# Altium schematic sheet AltiumFirst_STM32.SchDoc
size A4; SheetNumber: 1; SheetTotal: 1
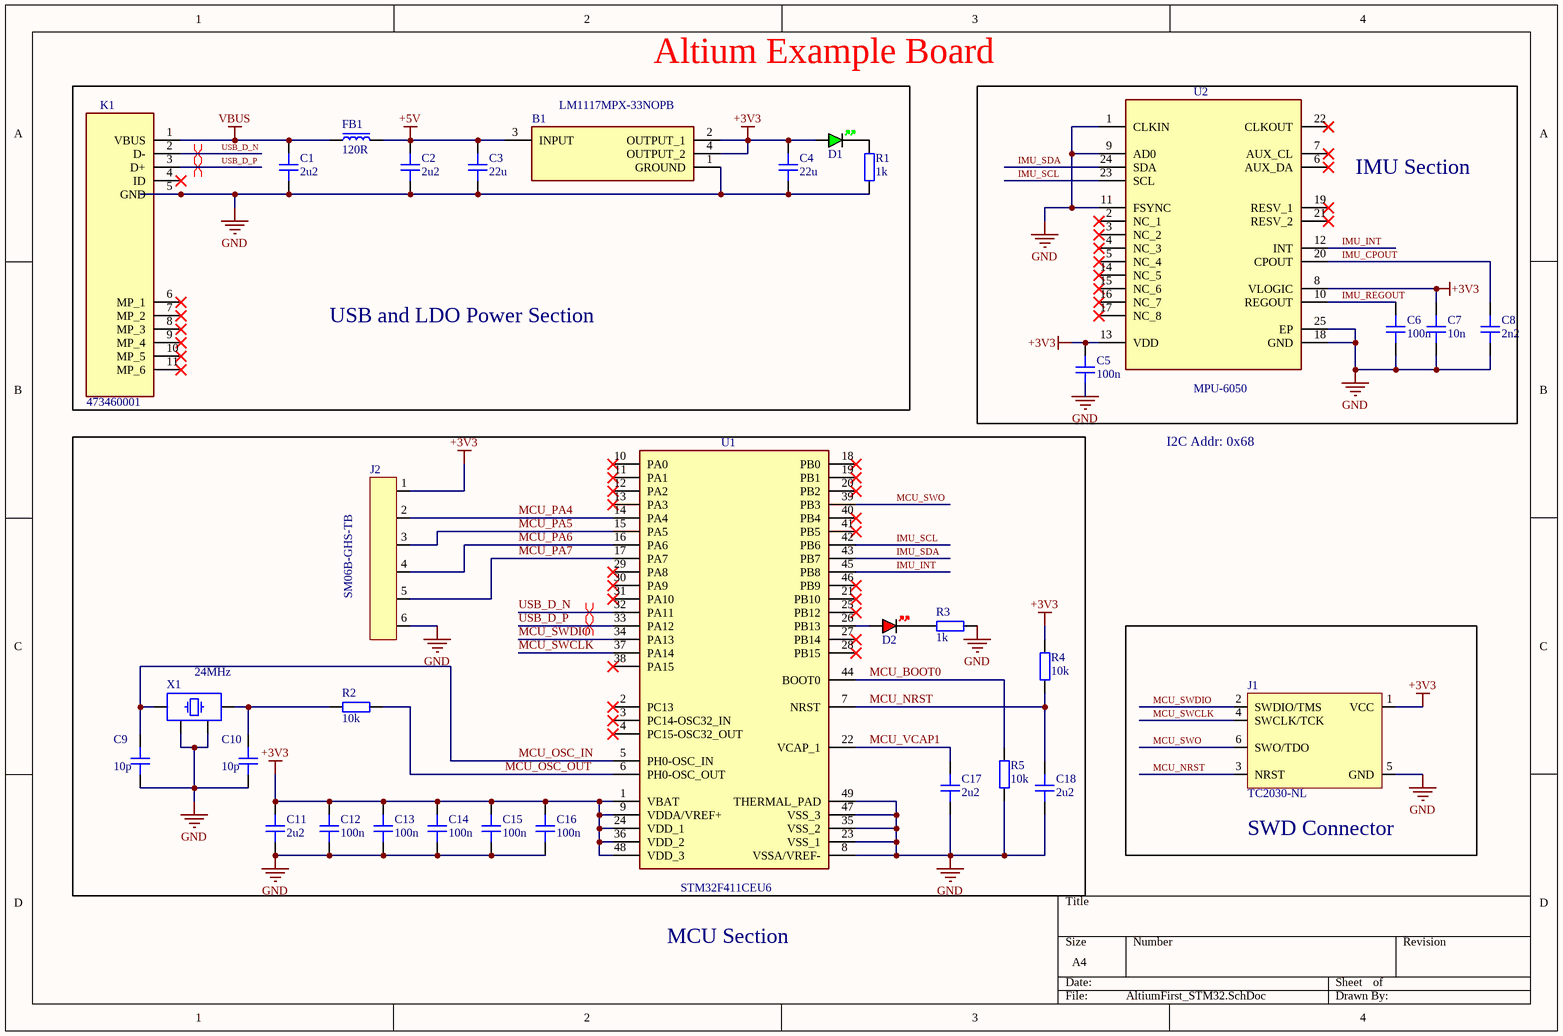
[diagram p0: AltiumFirst_STM32.SchDoc]

## Parts
B1  LM1117MPX-33NOPB  [SOT230P700X180-4N]
C1  2u2  [CAP_0603]
C2  2u2  [CAP_0603]
C3  22u  [CAP_0603]
C4  22u  [CAP_0603]
C5  100n  [CAP_0603]
C6  100n  [CAP_0603]
C7  10n  [CAP_0603]
C8  2n2  [CAP_0603]
C9  10p  [CAP_0603]
C10  10p  [CAP_0603]
C11  2u2  [CAP_0603]
C12  100n  [CAP_0603]
C13  100n  [CAP_0603]
C14  100n  [CAP_0603]
C15  100n  [CAP_0603]
C16  100n  [CAP_0603]
C17  2u2  [CAP_0603]
C18  2u2  [CAP_0603]
D1  GREEN  [LED_0603_GREEN]  (value not drawn)
D2  RED  [LED_0603_RED]  (value not drawn)
FB1  120R  [FB_0603]
J1  TC2030-NL  [TC2030-NL-FP]  (no BOM)
J2  SM06B-GHS-TB  [SM06B-GHS-TB]
K1  473460001  [473460001]
R1  1k  [RES_0603]
R2  10k  [RES_0603]
R3  1k  [RES_0603]
R4  10k  [RES_0603]
R5  10k  [RES_0603]
U1  STM32F411CEU6  [QFN50P700X700X60-49N-D]
U2  MPU-6050  [MPU6050]
X1  24MHz  [XTAL_3225]

## Blocks framed on the sheet
Altium Example Board: B1 C1-C4 D1 FB1 K1 R1
IMU Section: C5-C8 U2
SWD Connector: J1

## Nets
+3V3: B1.2(OUTPUT_1) B1.4(OUTPUT_2) C4.2 C5.2 C7.2 C11.2 C12.2 C13.2 C14.2 C15.2 C16.2 D1.A J1.1(VCC) J2.1 R4.2 U1.1(VBAT) U1.9(VDDA/VREF+) U1.24(VDD_1) U1.36(VDD_2) U1.48(VDD_3) U2.8(VLOGIC) U2.13(VDD)
+5V: B1.3(INPUT) C2.2 C3.2 FB1.2
GND: B1.1(GROUND) C1.1 C2.1 C3.1 C4.1 C5.1 C6.1 C7.1 C8.1 C9.1 C10.1 C11.1 C12.1 C13.1 C14.1 C15.1 C16.1 C17.1 C18.1 J1.5(GND) J2.6 K1.5(GND) R1.1 R3.1 R5.1 U1.8(VSSA/VREF-) U1.23(VSS_1) U1.35(VSS_2) U1.47(VSS_3) U1.49(THERMAL_PAD) U2.1(CLKIN) U2.9(AD0) U2.11(FSYNC) U2.18(GND) U2.25(EP) X1.2 X1.4
VBUS: C1.2 FB1.1 K1.1(VBUS)
IMU_CPOUT: C8.2 U2.20(CPOUT)
IMU_INT: U1.45(PB8) U2.12(INT)
IMU_REGOUT: C6.2 U2.10(REGOUT)
IMU_SCL: U1.42(PB6) U2.23(SCL)
IMU_SDA: U1.43(PB7) U2.24(SDA)
MCU_BOOT0: R5.2 U1.44(BOOT0)
MCU_NRST: C18.2 J1.3(NRST) R4.1 U1.7(NRST)
MCU_OSC_IN: C9.2 U1.5(PH0-OSC_IN) X1.1
MCU_OSC_OUT: R2.1 U1.6(PH0-OSC_OUT)
MCU_PA4: J2.2 U1.14(PA4)
MCU_PA5: J2.3 U1.15(PA5)
MCU_PA6: J2.4 U1.16(PA6)
MCU_PA7: J2.5 U1.17(PA7)
MCU_SWCLK: J1.4(SWCLK/TCK) U1.37(PA14)
MCU_SWDIO: J1.2(SWDIO/TMS) U1.34(PA13)
MCU_SWO: J1.6(SWO/TDO) U1.39(PB3)
MCU_VCAP1: C17.2 U1.22(VCAP_1)
USB_D_N: K1.2(D-) U1.32(PA11)
USB_D_P: K1.3(D+) U1.33(PA12)
NetC10_2: C10.2 R2.2 X1.3
NetD1_K: D1.K R1.2
NetD2_A: D2.A U1.26(PB13)
NetD2_K: D2.K R3.2

Not connected (* = marked no-connect by the designer): K1 4(ID)* 6(MP_1)* 7(MP_2)* 8(MP_3)* 9(MP_4)* 10(MP_5)* 11(MP_6)*; U1 2(PC13)* 3(PC14-OSC32_IN)* 4(PC15-OSC32_OUT)* 10(PA0)* 11(PA1)* 12(PA2)* 13(PA3)* 18(PB0)* 19(PB1)* 20(PB2)* 21(PB10)* 25(PB12)* 27(PB14)* 28(PB15)* 29(PA8)* 30(PA9)* 31(PA10)* 38(PA15)* 40(PB4)* 41(PB5)* 46(PB9)*; U2 2(NC_1)* 3(NC_2)* 4(NC_3)* 5(NC_4)* 6(AUX_DA)* 7(AUX_CL)* 14(NC_5)* 15(NC_6)* 16(NC_7)* 17(NC_8)* 19(RESV_1)* 21(RESV_2)* 22(CLKOUT)*

## Layout directives
differential pair; differential pair class DIFF_USB: USB_D_N, USB_D_P
differential pair: USB_D_N, USB_D_P

## Notes on the sheet
- USB and LDO Power Section
- I2C Addr: 0x68
- MCU Section

## Library data of the parts
B1 = LM1117MPX-33NOPB: Available in 1.8 V, 2.5 V, 3.3 V, 5 V, and Adjustable Versions; Space-saving SOT-223 package; Current limiting and thermal protection; Output current: 800 mA; Line regulation: 0.2% (maximum); Load regulation: 0.4% (maximum); Manufacturer_Name: onsemi; Geometry.Height: 1.8mm; Mouser Part Number: 863-LM1117MPX-33NOPB; Mouser Price/Stock: https://www.mouser.co.uk/ProductDetail/onsemi/LM1117MPX-33NOPB?qs=DPoM0jnrROUIbzbQHFmeig%3D%3D; Manufacturer_Part_Number: LM1117MPX-33NOPB; Datasheet Link: https://www.onsemi.com/pub/Collateral/LM1117-D.PDF
C1-C18 = CAP_0603: Capacitor SMD 0603; Manufacturer: *; Manufacturer Part Number: *; Distributor Link: *; LCSC: *; Rating: *; Dielectric: *
D1 = LED_0603_GREEN: LED 0603 GREEN SMD
D2 = LED_0603_RED: LED 0603 RED SMD
FB1 = FB_0603: Ferrite Bead SMD 0603; Manufacturer: *; Manufacturer Part Number: *; Distributor Link: *; LCSC: *
J1 = TC2030-NL: Tag-Connect No-Solder SWD Debug Connector (No Legs) DO NOT PLACE; Manufacturer: Tag-Connect; Manufacturer Part Number: TC2030-NL-FP
J2 = SM06B-GHS-TB: Header Connector 6 Position 1.25MM Pitch SMD Horizontal JST GH; Manufacturer: JST; Manufacturer Part Number: SM06B-GHS-TB
K1 = 47346-0001: Micro USB B Receptacle Bottom Mount Assy Molex Right Angle SMT Type B Version 2.0 Micro USB Connector Socket, 30 V ac, 1A 47352 MICRO-USB; Geometry.Height: 3.19mm; Mouser Part Number: 538-47346-0001; Mouser Price/Stock: https://www.mouser.co.uk/ProductDetail/Molex/47346-0001?qs=c2CV6XM0DweJBWaSeyWeCw%3D%3D; Manufacturer_Name: Molex; Manufacturer_Part_Number: 47346-0001; Datasheet Link: http://www.molex.com/pdm_docs/sd/473460001_sd.pdf
R1-R5 = RES_0603: Resistor SMD 0603; Manufacturer: *; Manufacturer Part Number: *; Distributor Link: *; LCSC: *
U1 = STM32F411CEU6: 32-Bit MCU 512K Flash 100MHz UFQFPN48 STMicroelectronics STM32F411CEU6, 32bit ARM Cortex M4 MCU, 100MHz, 512 kB Flash, 48-Pin UFQFPN; Geometry.Height: 0.6mm; Mouser Part Number: 511-STM32F411CEU6; Mouser Price/Stock: https://www.mouser.co.uk/ProductDetail/STMicroelectronics/STM32F411CEU6?qs=pjMTYa9MTGV3ou31YBFa3g%3D%3D; Manufacturer_Name: STMicroelectronics; Manufacturer_Part_Number: STM32F411CEU6; Datasheet Link: http://www.st.com/content/ccc/resource/technical/document/datasheet/b3/a5/46/3b/b4/e5/4c/85/DM00115249.pdf/files/DM00115249.pdf/jcr:content/translations/en.DM00115249.pdf
U2 = MPU-6050: IMUs - Inertial Measurement Units 6-Axis MEMS MotionTracking  Device with DMP; Manufacturer_Name: TDK; Geometry.Height: 0.95mm; Mouser Part Number: 410-MPU-6050; Mouser Price/Stock: https://www.mouser.co.uk/ProductDetail/TDK-InvenSense/MPU-6050?qs=u4fy%2FsgLU9O14B5JgyQFvg%3D%3D; Manufacturer_Part_Number: MPU-6050; Datasheet Link: https://product.tdk.com/system/files/dam/doc/product/sensor/mortion-inertial/imu/data_sheet/mpu-6000-datasheet1.pdf
X1 = TSX-3225_24.0000MF15X-AC: Crystal SMD 24MHz 10PPM 7pF 3225; Manufacturer: Epson; Manufacturer Part Number: TSX-3225 24.0000MF15X-AC